# Altium schematic sheet [14] - PWR 5V, 3V3, 2V5.SchDoc
size A2; DocumentNumber: 14; SheetNumber: 14; SheetTotal: 18
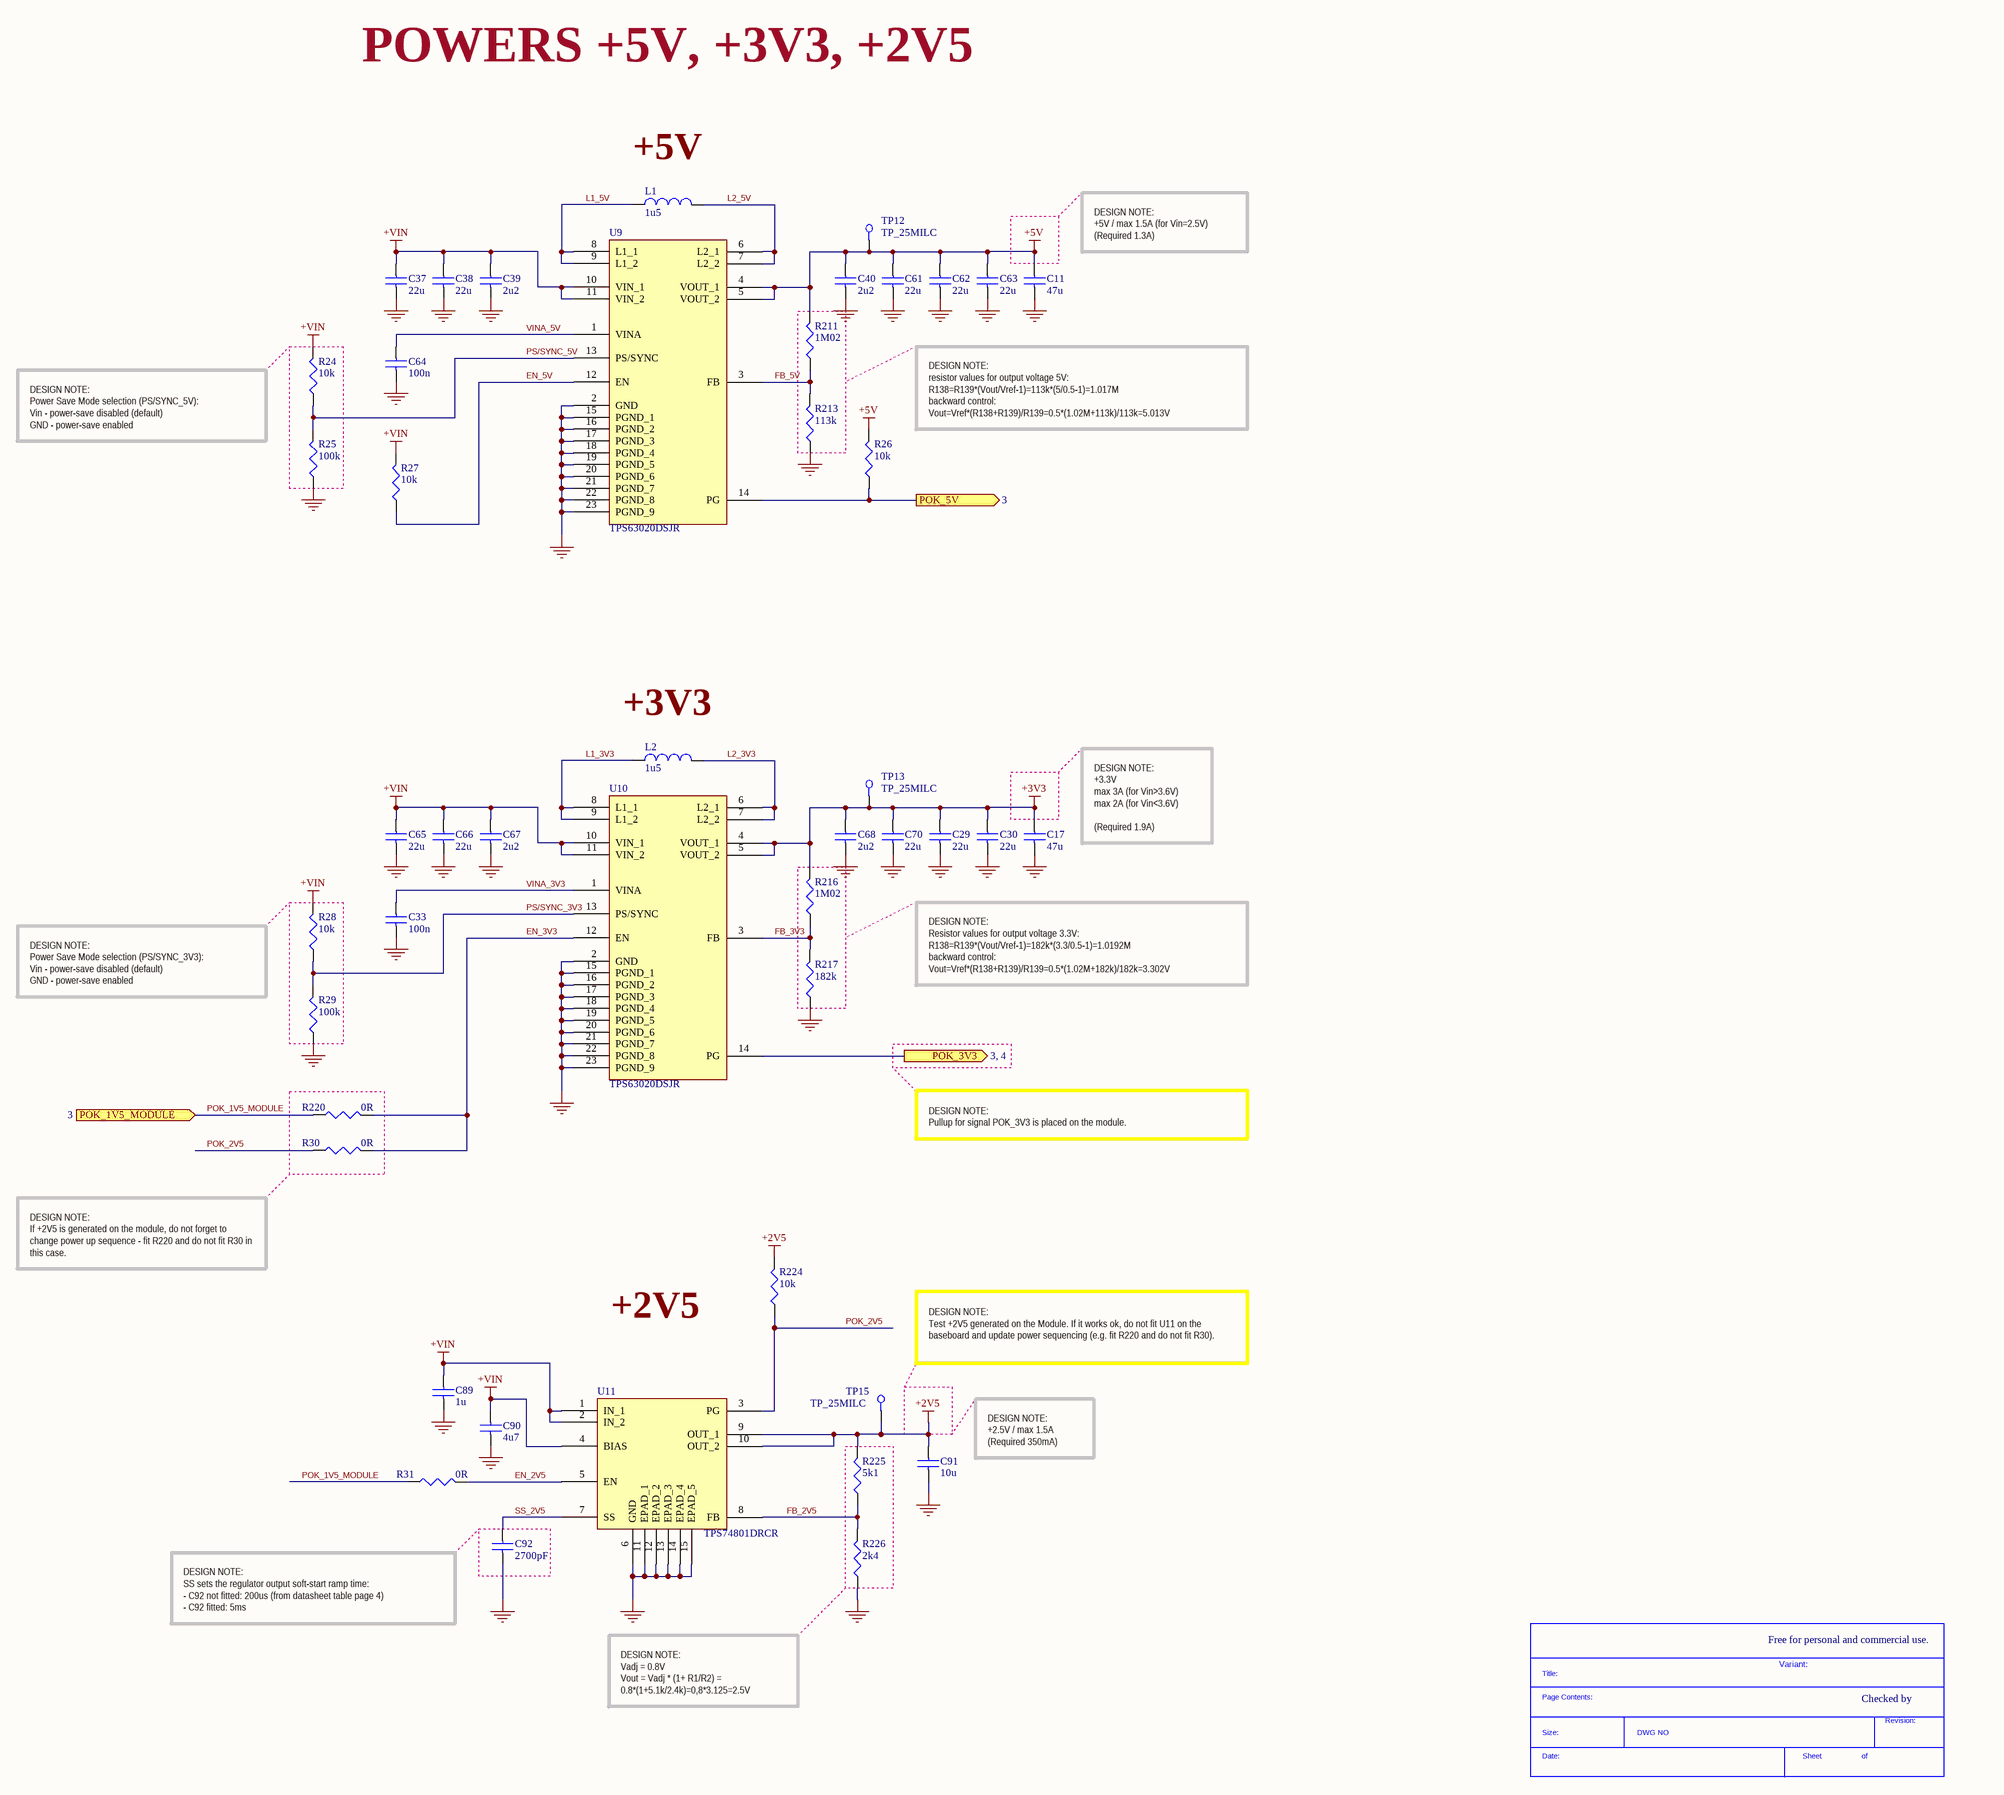
[diagram p0: [14] - PWR 5V, 3V3, 2V5.SchDoc]

## Parts
*  SDTitleBlock  (value not drawn)  (graphical)
C11  47u  [C0805]
C17  47u  [C0805]
C29  22u  [C0603]
C30  22u  [C0603]
C33  100n  [C0402]
C37  22u  [C0603]
C38  22u  [C0603]
C39  2u2  [C0402]
C40  2u2  [C0402]
C61  22u  [C0603]
C62  22u  [C0603]
C63  22u  [C0603]
C64  100n  [C0402]
C65  22u  [C0603]
C66  22u  [C0603]
C67  2u2  [C0402]
C68  2u2  [C0402]
C70  22u  [C0603]
C89  1u  [C0402]
C90  4u7  [C0402]
C91  10u  [C0603]
C92  2700pF  [C0402]
L1  1u5  [IHLP_204MILX216MIL]
L2  1u5  [IHLP_204MILX216MIL]
R24  10k  [R0402]
R25  100k  [R0402]
R26  10k  [R0402]
R27  10k  [R0402]
R28  10k  [R0402]
R29  100k  [R0402]
R30  0R  [R0402]
R31  0R  [R0402]
R211  1M02  [R0402]
R213  113k  [R0402]
R216  1M02  [R0402]
R217  182k  [R0402]
R220  0R  [R0402]
R224  10k  [R0402]
R225  5k1  [R0402]
R226  2k4  [R0402]
TP12  TP_25MILC  [TP_25C]  (no BOM)
TP13  TP_25MILC  [TP_25C]  (no BOM)
TP15  TP_25MILC  [TP_25C]  (no BOM)
U9  TPS63020DSJR  [DSJ (R-PVSON-N14)]
U10  TPS63020DSJR  [DSJ (R-PVSON-N14)]
U11  TPS74801DRCR  [DRC (S-PVSON-N10)]

## Ports
POK_1V5_MODULE (in, see 3), POK_3V3 (see 3, 4), POK_5V (out, see 3)

## Nets
+2V5: C91.1 R224.2 R225.2 TP15.1 U11.9(OUT_1) U11.10(OUT_2)
+3V3: C17.1 C29.1 C30.1 C68.1 C70.1 R216.2 TP13.1 U10.4(VOUT_1) U10.5(VOUT_2)
+5V: C11.1 C40.1 C61.1 C62.1 C63.1 R26.2 R211.2 TP12.1 U9.4(VOUT_1) U9.5(VOUT_2)
+VIN: C37.1 C38.1 C39.1 C65.1 C66.1 C67.1 C89.1 C90.1 R24.2 R27.2 R28.2 U9.10(VIN_1) U9.11(VIN_2) U10.10(VIN_1) U10.11(VIN_2) U11.1(IN_1) U11.2(IN_2) U11.4(BIAS)
GND: C11.2 C17.2 C29.2 C30.2 C33.2 C37.2 C38.2 C39.2 C40.2 C61.2 C62.2 C63.2 C64.2 C65.2 C66.2 C67.2 C68.2 C70.2 C89.2 C90.2 C91.2 C92.2 R25.1 R29.1 R213.1 R217.1 R226.1 U9.2(GND) U9.15(PGND_1) U9.16(PGND_2) U9.17(PGND_3) U9.18(PGND_4) U9.19(PGND_5) U9.20(PGND_6) U9.21(PGND_7) U9.22(PGND_8) U9.23(PGND_9) U10.2(GND) U10.15(PGND_1) U10.16(PGND_2) U10.17(PGND_3) U10.18(PGND_4) U10.19(PGND_5) U10.20(PGND_6) U10.21(PGND_7) U10.22(PGND_8) U10.23(PGND_9) U11.6(GND) U11.11(EPAD_1) U11.12(EPAD_2) U11.13(EPAD_3) U11.14(EPAD_4) U11.15(EPAD_5)
EN_2V5: R31.2 U11.5(EN)
EN_3V3: R30.2 R220.2 U10.12(EN)
EN_5V: R27.1 U9.12(EN)
FB_2V5: R225.1 R226.2 U11.8(FB)
FB_3V3: R216.1 R217.2 U10.3(FB)
FB_5V: R211.1 R213.2 U9.3(FB)
L1_3V3: L2.1 U10.8(L1_1) U10.9(L1_2)
L1_5V: L1.1 U9.8(L1_1) U9.9(L1_2)
L2_3V3: L2.2 U10.6(L2_1) U10.7(L2_2)
L2_5V: L1.2 U9.6(L2_1) U9.7(L2_2)
POK_1V5_MODULE: R31.1 R220.1 ; port POK_1V5_MODULE
POK_2V5: R30.1 R224.1 U11.3(PG)
POK_3V3: U10.14(PG) ; port POK_3V3
POK_5V: R26.1 U9.14(PG) ; port POK_5V
PS/SYNC_3V3: R28.1 R29.2 U10.13(PS/SYNC)
PS/SYNC_5V: R24.1 R25.2 U9.13(PS/SYNC)
SS_2V5: C92.1 U11.7(SS)
VINA_3V3: C33.1 U10.1(VINA)
VINA_5V: C64.1 U9.1(VINA)

## Notes on the sheet
- POWERS +5V, +3V3, +2V5
- (near L1) +5V
- DESIGN NOTE:
  +5V / max 1.5A (for Vin=2.5V)
  (Required 1.3A)
- DESIGN NOTE:
  Power Save Mode selection (PS/SYNC_5V):
  Vin - power-save disabled (default)
  GND - power-save enabled
- DESIGN NOTE:
  resistor values for output voltage 5V:
  R138=R139*(Vout/Vref-1)=113k*(5/0.5-1)=1.017M
  backward control:
  Vout=Vref*(R138+R139)/R139=0.5*(1.02M+113k)/113k=5.013V
- (near L2) +3V3
- DESIGN NOTE:
  +3.3V
  max 3A (for Vin>3.6V)
  max 2A (for Vin<3.6V)
  (Required 1.9A)
- DESIGN NOTE:
  Power Save Mode selection (PS/SYNC_3V3):
  Vin - power-save disabled (default)
  GND - power-save enabled
- DESIGN NOTE:
  Resistor values for output voltage 3.3V:
  R138=R139*(Vout/Vref-1)=182k*(3.3/0.5-1)=1.0192M
  backward control:
  Vout=Vref*(R138+R139)/R139=0.5*(1.02M+182k)/182k=3.302V
- DESIGN NOTE:
  Pullup for signal POK_3V3 is placed on the module.
- DESIGN NOTE:
  If +2V5 is generated on the module, do not forget to change power up sequence - fit R220 and do not fit R30 in this case.
- +2V5
- DESIGN NOTE:
  Test +2V5 generated on the Module. If it works ok, do not fit U11 on the baseboard and update power sequencing (e.g. fit R220 and do not fit R30).
- DESIGN NOTE:
  +2.5V / max 1.5A
  (Required 350mA)
- DESIGN NOTE:
  SS sets the regulator output soft-start ramp time:
  - C92 not fitted: 200us (from datasheet table page 4)
  - C92 fitted: 5ms
- Free for personal and commercial use.
- DESIGN NOTE:
  Vadj = 0.8V
  Vout = Vadj * (1+ R1/R2) = 0.8*(1+5.1k/2.4k)=0,8*3.125=2.5V
- Variant:
- Checked by
- (in symbol SDTitleBlock) Title:; Page Contents:; Revision:; Size:; DWG NO; Date:; Sheet; of

## Library data of the parts
C11 C17 = JMK212BJ476MG-T: CAP CER 47UF 6.3V 20% X5R 0805; Manufacturer: Taiyo Yuden; Capacitance: 47µF; .Creator: MM; Supplier 1: Digi-Key; Manufacturer Part Number: JMK212BJ476MG-T; RoHS: RoHS Compliant; Category: Capacitors; Stock 1: 34061; Pricing 1: 1=0.77, 10=0.737, 50=0.44, 100=0.3575, 250=0.297, 500=0.2695, 1000=0.2475 (USD); Packaging: Cut Tape (CT); Tolerance: ±20%; Voltage - Rated: 6.3V; Temperature Coefficient: X5R; Mounting Type: Surface Mount, MLCC; Operating Temperature: -55°C ~ 85°C; Applications: General Purpose; Ratings: -; Package / Case: 0805 (2012 Metric); Size / Dimension: 0.079" L x 0.049" W (2.00mm x 1.25mm); Height - Seated (Max): -; Thickness (Max): 0.053" (1.35mm); Lead Spacing: -; Features: -; Lead Style: -; ComponentLink1URL: http://www.yuden.co.jp/productdata/catalog/en/mlcc_all_e.pdf; ComponentLink1Description: http://www.yuden.co.jp/productdata/catalog/en/mlcc_all_e.pdf; Supplier Part Number 1: 587-1779-1-ND; .Checked SCH: MM; .Checked PCB: MM
C29 C30 C37 C38 C61-C63 C65 C66 C70 = C1608X5R0J226M080AC: CAP CER 22UF 6.3V 20% X5R 0603; Manufacturer: TDK Corporation; Capacitance: 22µF; .Creator: MM; Supplier 1: Digi-Key; Manufacturer Part Number: C1608X5R0J226M080AC; RoHS: RoHS Compliant; Category: Capacitors; Stock 1: 593047; Pricing 1: 1=0.39, 10=0.343, 100=0.1714, 250=0.13708, 500=0.12484, 1000=0.1104 (USD); Packaging: Cut Tape (CT); Tolerance: ±20%; Voltage - Rated: 6.3V; Temperature Coefficient: X5R; Mounting Type: Surface Mount, MLCC; Operating Temperature: -55°C ~ 85°C; Applications: General Purpose; Ratings: -; Package / Case: 0603 (1608 Metric); Size / Dimension: 0.063" L x 0.031" W (1.60mm x 0.80mm); Height - Seated (Max): -; Thickness (Max): 0.039" (1.00mm); Lead Spacing: -; Features: -; Lead Style: -; ComponentLink1URL: http://product.tdk.com/en/catalog/datasheets/mlcc_commercial_general_en.pdf; ComponentLink1Description: http://product.tdk.com/en/catalog/datasheets/mlcc_commercial_general_en.pdf; Supplier Part Number 1: 445-8028-1-ND; .Checked PCB: MM; .Checked SCH: MM
C33 C64 = C1005X5R1H104K: CAP CER .10UF 50V X5R 10% 0402; Manufacturer: TDK Corporation; Capacitance: 0.1µF; Value: 100nF; .Checked PCB: used; Category: Capacitors; Supplier Part Number: 445-5942-1-ND; Manufacturer Part Number: C1005X5R1H104K; Operating Temperature: -55°C ~ 85°C; Package / Case: 0402 (1005 Metric); Price 1k [$]: 0.02340; .Checked SCH: used; Voltage - Rated: 50V; Supplier: Digikey; Supplier 1: Digi-Key; Supplier Part Number 1: 445-5942-1-ND; RoHS: RoHS Compliant; Stock 1: 106926; Pricing 1: 1=0.27, 10=0.18, 100=0.072, 250=0.05176, 500=0.0369, 1000=0.027 (USD); Tolerance: ±10%; Temperature Coefficient: X5R; Mounting Type: Surface Mount, MLCC; Applications: General Purpose; Ratings: -; Size / Dimension: 0.039" L x 0.020" W (1.00mm x 0.50mm); Height - Seated (Max): -; Thickness (Max): 0.022" (0.55mm); Lead Spacing: -; Features: -; Packaging: Cut Tape (CT); Lead Style: -; ComponentLink1URL: http://www.tdk.co.jp/tefe02/e412_c.pdf; ComponentLink1Description: http://www.tdk.co.jp/tefe02/e412_c.pdf
C39 C40 C67 C68 = C1005X5R1A225K: CAP CER 2.2UF 10V 10% X5R 0402; Manufacturer: TDK Corporation; Capacitance: 2.2µF; .Checked PCB: used; Supplier 1: Digi-Key; Supplier Part Number 1: 445-7392-1-ND; Manufacturer Part Number: C1005X5R1A225K; RoHS: RoHS Compliant; Category: Capacitors; Stock 1: 22891; Pricing 1: 1=0.42, 10=0.332, 100=0.2, 250=0.15, 500=0.128, 1000=0.1 (USD); Voltage - Rated: 10V; Tolerance: ±10%; Temperature Coefficient: X5R; Mounting Type: Surface Mount, MLCC; Operating Temperature: -55°C ~ 85°C; Applications: General Purpose; Ratings: -; Package / Case: 0402 (1005 Metric); Size / Dimension: 0.039" L x 0.020" W (1.00mm x 0.50mm); Height - Seated (Max): -; Thickness (Max): 0.022" (0.55mm); Lead Spacing: -; Features: -; Packaging: Cut Tape (CT); Lead Style: -; ComponentLink1URL: http://www.tdk.com/pdf/general_B11.pdf; ComponentLink1Description: http://www.tdk.com/pdf/general_B11.pdf; .Checked SCH: used
C89 = C1005X5R1C105K: CAP CER 1.0UF 16V X5R 0402; Manufacturer: TDK Corporation; Capacitance: 1.0µF; Value: 1uF; .Checked PCB: used; Tolerance: ±10%; Category: Capacitors; Supplier Part Number: 445-4978-1-ND; Manufacturer Part Number: C1005X5R1C105K; Operating Temperature: -55°C ~ 85°C; Package / Case: 0402 (1005 Metric); Price 1k [$]: 0.02080; .Checked SCH: used; Voltage - Rated: 16V; Supplier: Digikey; Supplier 1: Digi-Key; Supplier Part Number 1: 445-4978-1-ND; RoHS: RoHS Compliant; Stock 1: 341010; Pricing 1: 1=0.24, 10=0.16, 100=0.064, 250=0.046, 500=0.0328, 1000=0.024 (USD); Temperature Coefficient: X5R; Mounting Type: Surface Mount, MLCC; Applications: General Purpose; Ratings: -; Size / Dimension: 0.039" L x 0.020" W (1.00mm x 0.50mm); Height - Seated (Max): -; Thickness (Max): 0.022" (0.55mm); Lead Spacing: -; Features: -; Packaging: Cut Tape (CT); Lead Style: -; ComponentLink1URL: http://www.tdk.co.jp/tefe02/e412_c.pdf; ComponentLink1Description: http://www.tdk.co.jp/tefe02/e412_c.pdf
C90 = C1005X5R1A475M: CAP CER 4.7UF 10V 20% X5R 0402; Manufacturer: TDK Corporation; Capacitance: 4.7µF; .Checked PCB: used; Supplier 1: Digi-Key; Supplier Part Number 1: 445-8023-1-ND; Manufacturer Part Number: C1005X5R1A475M; RoHS: RoHS Compliant; Category: Capacitors; Stock 1: 10140; Pricing 1: 1=0.53, 10=0.415, 100=0.25, 250=0.18752, 500=0.16, 1000=0.125, 5000=0.095 (USD); Voltage - Rated: 10V; Tolerance: ±20%; Temperature Coefficient: X5R; Mounting Type: Surface Mount, MLCC; Operating Temperature: -55°C ~ 85°C; Applications: General Purpose; Ratings: -; Package / Case: 0402 (1005 Metric); Size / Dimension: 0.039" L x 0.020" W (1.00mm x 0.50mm); Height - Seated (Max): -; Thickness (Max): -; Lead Spacing: -; Features: -; Packaging: Cut Tape (CT); Lead Style: -; ComponentLink1URL: http://www.tdk.com/pdf/general_B11.pdf; ComponentLink1Description: http://www.tdk.com/pdf/general_B11.pdf; .Checked SCH: used
C91 = C1608X5R0J106M: CAP CER 10UF 6.3V X5R 20% 0603; Manufacturer: TDK Corporation; Capacitance: 10µF; Value: 10µF; .Checked PCB: used; Category: Capacitors; Supplier Part Number: 445-4112-1-ND; Manufacturer Part Number: C1608X5R0J106M; Operating Temperature: -55°C ~ 85°C; Package / Case: 0603 (1608 Metric); Price 1k [$]: 0.08580; .Checked SCH: used; Voltage - Rated: 6.3V; Features: Low ESR; Supplier: Digikey; Supplier 1: Digi-Key; Supplier Part Number 1: 445-4112-1-ND; RoHS: RoHS Compliant; Stock 1: 48157; Pricing 1: 1=0.46, 10=0.363, 100=0.1898, 250=0.14024, 500=0.1089, 1000=0.0858 (USD); Tolerance: ±20%; Temperature Coefficient: X5R; Mounting Type: Surface Mount, MLCC; Applications: General Purpose; Ratings: -; Size / Dimension: 0.063" L x 0.031" W (1.60mm x 0.80mm); Height - Seated (Max): -; Thickness (Max): 0.037" (0.95mm); Lead Spacing: -; Packaging: Cut Tape (CT); Lead Style: -; ComponentLink1URL: http://www.tdk.com/pdf/general_B11.pdf; ComponentLink1Description: http://www.tdk.com/pdf/general_B11.pdf
C92 = GRM155R71H272KA01D: CAP CER 2700PF 50V 10% X7R 0402; Manufacturer: Murata Electronics North America; .Checked PCB: used; Supplier 1: Digi-Key; Supplier Part Number 1: 490-1306-1-ND; Manufacturer Part Number: GRM155R71H272KA01D; RoHS: RoHS Compliant; Category: Capacitors; Stock 1: 38160; Pricing 1: 10=0.01, 50=0.0086, 100=0.0074, 250=0.00664, 500=0.00618, 750=0.00571, 1000=0.00542 (USD); Capacitance: 2700pF; Voltage - Rated: 50V; Tolerance: ±10%; Temperature Coefficient: X7R; Mounting Type: Surface Mount, MLCC; Operating Temperature: -55°C ~ 125°C; Applications: General Purpose; Ratings: -; Package / Case: 0402 (1005 Metric); Size / Dimension: 0.039" L x 0.020" W (1.00mm x 0.50mm); Height - Seated (Max): -; Thickness (Max): 0.022" (0.55mm); Lead Spacing: -; Features: -; Packaging: Cut Tape (CT); Lead Style: -; ComponentLink1URL: http://search.murata.co.jp/Ceramy/image/img/PDF/ENG/GRM155R71H272KA01.pdf; ComponentLink1Description: http://search.murata.co.jp/Ceramy/image/img/PDF/ENG/GRM155R71H272KA01.pdf; .Checked SCH: used
L1 L2 = IHLP2020CZER1R5M11: FIXED IND 1.5UH 7.5A 18.5 MOHM; Manufacturer: Vishay Dale; Type: Molded; Inductance: 1.5µH; Tolerance: ±20%; Current - Saturation: 7A; Shielding: Shielded; DC Resistance (DCR): 18.5 mOhm Max; Frequency - Self Resonant: 39MHz; Frequency - Test: 100kHz; .Creator: MM; Supplier 1: Digi-Key; Manufacturer Part Number: IHLP2020CZER1R5M11; RoHS: RoHS Compliant; Category: Inductors, Coils, Chokes; Stock 1: 5892; Pricing 1: 1=2.4, 10=2.24, 100=1.664, 500=1.408, 1000=1.312 (USD); Packaging: Cut Tape (CT); Material - Core: -; Current Rating: 7.5A; Q @ Freq: -; Operating Temperature: -55°C ~ 125°C; Mounting Type: Surface Mount; Package / Case: Non Standard; Size / Dimension: 0.216" L x 0.204" W (5.49mm x 5.18mm); Height - Seated (Max): 0.118" (3.00mm); Supplier Device Package: -; ComponentLink1URL: http://www.vishay.com/docs/34260/lp20cz11.pdf; ComponentLink1Description: http://www.vishay.com/docs/34260/lp20cz11.pdf; Supplier Part Number 1: 541-1235-1-ND; .Checked PCB: MM; .Checked SCH: MM
R24 R26-R28 R224 = RC0402FR-0710KL: RES 10.0K OHM 1/16W 1% 0402 SMD; Manufacturer: Yageo; Power (Watts): 0.063W, 1/16W; .Checked PCB: used; Temperature Coefficient: ±100ppm/°C; Category: Resistors; Supplier Part Number: 311-10.0KLRCT-ND; Manufacturer Part Number: RC0402FR-0710KL; Package / Case: 0402 (1005 Metric); Price 1k [$]: 0.01421; Resistance (Ohms): 10K; Tolerance: ±1%; Value: 10k; .Checked SCH: used; Supplier: Digikey; Supplier 1: Digi-Key; Supplier Part Number 1: 311-10.0KLRCT-ND; RoHS: RoHS Compliant; Stock 1: 2916495; Pricing 1: 10=0.014, 50=0.0104, 100=0.0079, 250=0.00584, 500=0.00432, 1000=0.00288 (USD); Composition: Thick Film; Features: -; Size / Dimension: 0.039" L x 0.020" W (1.00mm x 0.50mm); Height: 0.016" (0.40mm); Number of Terminations: 2; Packaging: Cut Tape (CT); ComponentLink1URL: http://www.yageo.com/documents/recent/PYu-RC0402_51_RoHS_L_6.pdf; ComponentLink1Description: http://www.yageo.com/documents/recent/PYu-RC0402_51_RoHS_L_6.pdf
R25 R29 = RMCF0402FT100K: RES 100K OHM 1/16W 1% 0402 SMD; Manufacturer: Stackpole Electronics Inc; Power (Watts): 0.063W, 1/16W; .Checked PCB: used; Temperature Coefficient: ±100ppm/°C; Category: Resistors; Supplier Part Number: RMCF0402FT100KCT-ND; Manufacturer Part Number: RMCF0402FT100K; Package / Case: 0402 (1005 Metric); Price 1k [$]: 0.00384; Resistance (Ohms): 100K; Tolerance: ±1%; Value: 100k; .Checked SCH: used; Supplier: Digikey; Supplier 1: Digi-Key; Supplier Part Number 1: RMCF0402FT100KCT-ND; RoHS: RoHS Compliant; Stock 1: 95; Pricing 1: 1=0.04, 10=0.025, 50=0.0138, 100=0.0105, 250=0.0078, 500=0.00576, 1000=0.00384 (USD); Composition: Thick Film; Features: -; Size / Dimension: 0.039" L x 0.020" W (1.00mm x 0.50mm); Height: 0.016" (0.40mm); Number of Terminations: 2; Packaging: Cut Tape (CT); ComponentLink1URL: http://www.seielect.com/Catalog/SEI-RMCF.pdf; ComponentLink1Description: http://www.seielect.com/Catalog/SEI-RMCF.pdf
R30 R31 R220 = RC0402JR-070RL: RES 0.0 OHM 1/16W 0402 SMD; Manufacturer: Yageo; Resistance (Ohms): 0.0; Power (Watts): 0.063W, 1/16W; Tolerance: Jumper; .Checked PCB: used; Category: Resistors; Supplier Part Number: 311-0.0JRCT-ND; Manufacturer Part Number: RC0402JR-070RL; Package / Case: 0402 (1005 Metric); Price 1k [$]: 0.01389; Value: 0R; .Checked SCH: used; Supplier: Digikey; Supplier 1: Digi-Key; Supplier Part Number 1: 311-0.0JRCT-ND; RoHS: RoHS Compliant; Stock 1: 1106330; Pricing 1: 10=0.012, 50=0.009, 100=0.0069, 250=0.00512, 500=0.0038, 1000=0.00253 (USD); Composition: Thick Film; Features: -; Temperature Coefficient: -; Size / Dimension: 0.039" L x 0.020" W (1.00mm x 0.50mm); Height: 0.016" (0.40mm); Number of Terminations: 2; Packaging: Cut Tape (CT); ComponentLink1URL: http://www.yageo.com/documents/recent/PYu-RC0402_51_RoHS_L_6.pdf; ComponentLink1Description: http://www.yageo.com/documents/recent/PYu-RC0402_51_RoHS_L_6.pdf
R211 R216 = CRCW04021M02FKED: RES 1.02M OHM 1/16W 1% 0402 SMD; Manufacturer: Vishay Dale; Power (Watts): 0.063W, 1/16W; Temperature Coefficient: ±100ppm/°C; .Creator: MM; Supplier 1: Digi-Key; Manufacturer Part Number: CRCW04021M02FKED; RoHS: RoHS Compliant; Category: Resistors; Stock 1: 38338; Pricing 1: 10=0.083, 50=0.0444, 200=0.0255, 1000=0.0174 (USD); Packaging: Cut Tape (CT); Resistance (Ohms): 1.02M; Tolerance: ±1%; Composition: Thick Film; Features: Automotive AEC-Q200 Qualified; Package / Case: 0402 (1005 Metric); Supplier Device Package: 0402 (1005 Metric); Size / Dimension: 0.039" L x 0.020" W (1.00mm x 0.50mm); Height: 0.016" (0.40mm); Number of Terminations: 2; ComponentLink1URL: http://www.vishay.com/docs/20035/dcrcwe3.pdf; ComponentLink1Description: http://www.vishay.com/docs/20035/dcrcwe3.pdf; Supplier Part Number 1: 541-1.02MLCT-ND; .Checked PCB: MM; .Checked SCH: MM
R213 = CRCW0402113KFKED: RES 113K OHM 1/16W 1% 0402 SMD; Manufacturer: Vishay Dale; Power (Watts): 0.063W, 1/16W; Temperature Coefficient: ±100ppm/°C; .Creator: MM; Supplier 1: Digi-Key; Manufacturer Part Number: CRCW0402113KFKED; RoHS: RoHS Compliant; Category: Resistors; Stock 1: 66504; Pricing 1: 10=0.083, 50=0.0444, 200=0.0255, 1000=0.0174 (USD); Packaging: Cut Tape (CT); Resistance (Ohms): 113k; Tolerance: ±1%; Composition: Thick Film; Features: Automotive AEC-Q200 Qualified; Package / Case: 0402 (1005 Metric); Supplier Device Package: 0402 (1005 Metric); Size / Dimension: 0.039" L x 0.020" W (1.00mm x 0.50mm); Height: 0.016" (0.40mm); Number of Terminations: 2; ComponentLink1URL: http://www.vishay.com/docs/20035/dcrcwe3.pdf; ComponentLink1Description: http://www.vishay.com/docs/20035/dcrcwe3.pdf; Supplier Part Number 1: 541-113KLCT-ND; .Checked PCB: MM; .Checked SCH: MM
R217 = CRCW0402182KFKED: RES 182K OHM 1/16W 1% 0402 SMD; Manufacturer: Vishay Dale; Power (Watts): 0.063W, 1/16W; Temperature Coefficient: ±100ppm/°C; .Creator: MM; Supplier 1: Digi-Key; Manufacturer Part Number: CRCW0402182KFKED; RoHS: RoHS Compliant; Category: Resistors; Stock 1: 98035; Pricing 1: 10=0.083, 50=0.0444, 200=0.0255, 1000=0.0174 (USD); Packaging: Cut Tape (CT); Resistance (Ohms): 182k; Tolerance: ±1%; Composition: Thick Film; Features: Automotive AEC-Q200 Qualified; Package / Case: 0402 (1005 Metric); Supplier Device Package: 0402 (1005 Metric); Size / Dimension: 0.039" L x 0.020" W (1.00mm x 0.50mm); Height: 0.016" (0.40mm); Number of Terminations: 2; ComponentLink1URL: http://www.vishay.com/docs/20035/dcrcwe3.pdf; ComponentLink1Description: http://www.vishay.com/docs/20035/dcrcwe3.pdf; Supplier Part Number 1: 541-182KLCT-ND; .Checked PCB: MM; .Checked SCH: MM
R225 = RC0402FR-075K1L: RES 5.10K OHM 1/16W 1% 0402 SMD; Manufacturer: Yageo; Resistance (Ohms): 5.1K; Power (Watts): 0.063W, 1/16W; .Checked PCB: RF; Temperature Coefficient: ±100ppm/°C; Category: Resistors; Supplier Part Number: 311-5.10KLRCT-ND; Manufacturer Part Number: RC0402FR-075K1L; Package / Case: 0402 (1005 Metric); Price 1k [$]: 0.00288; Tolerance: ±1%; Value: 5k1; .Checked SCH: RF; Supplier: Digikey; Supplier 1: Digi-Key; Supplier Part Number 1: 311-5.10KLRCT-ND; RoHS: RoHS Compliant; Stock 1: 571594; Pricing 1: 10=0.014, 50=0.0104, 100=0.0079, 250=0.00584, 500=0.00432, 1000=0.00288 (USD); Composition: Thick Film; Features: -; Size / Dimension: 0.039" L x 0.020" W (1.00mm x 0.50mm); Height: 0.016" (0.40mm); Number of Terminations: 2; Packaging: Cut Tape (CT); ComponentLink1URL: http://www.yageo.com/documents/recent/PYu-RC0402_51_RoHS_L_6.pdf; ComponentLink1Description: http://www.yageo.com/documents/recent/PYu-RC0402_51_RoHS_L_6.pdf
R226 = CRCW04022K40FKED: RES 2.40K OHM 1/16W 1% 0402 SMD; Manufacturer: Vishay Dale; Resistance (Ohms): 2.4K; Power (Watts): 0.063W, 1/16W; Temperature Coefficient: ±100ppm/°C; .Checked PCB: used; Supplier 1: Digi-Key; Supplier Part Number 1: 541-2.40KLCT-ND; Manufacturer Part Number: CRCW04022K40FKED; RoHS: RoHS Compliant; Category: Resistors; Stock 1: 43967; Pricing 1: 10=0.083, 50=0.0444, 200=0.0255, 1000=0.0174 (USD); Composition: Thick Film; Features: -; Tolerance: ±1%; Package / Case: 0402 (1005 Metric); Size / Dimension: 0.039" L x 0.020" W (1.00mm x 0.50mm); Height: 0.016" (0.40mm); Number of Terminations: 2; Packaging: Cut Tape (CT); ComponentLink1URL: http://www.vishay.com/doc?20035; ComponentLink1Description: http://www.vishay.com/doc?20035; .Checked SCH: used
TP12 TP13 TP15 = TP_25MILC: Test Point 25mil
U9 U10 = TPS63020DSJR: IC REG BUCK BST SYNC ADJ 14VSON; Manufacturer: Texas Instruments; Output Type: Adjustable; Number of Outputs: 1; Voltage - Output: 1.2 V ~ 5.5 V; Voltage - Input: 1.8 V ~ 5.5 V; Frequency - Switching: 2.4MHz; Current - Output: 3A; Synchronous Rectifier: Yes; .Creator: MM; Supplier 1: Digi-Key; Manufacturer Part Number: TPS63020DSJR; RoHS: RoHS Compliant; Category: Integrated Circuits (ICs); Stock 1: 3608; Pricing 1: 1=4.92, 10=4.412, 25=3.9672, 100=3.6081, 250=3.26612, 500=2.9241, 750=2.65051, 1000=2.1375 (USD); Packaging: Cut Tape (CT); Type: Step-Down (Buck), Step-Up (Boost); Operating Temperature: -40°C ~ 85°C; Mounting Type: Surface Mount; Package / Case: 14-VFDFN Exposed Pad; Supplier Device Package: 14-VSON (4x3); ComponentLink1URL: http://www.ti.com/lit/ds/symlink/tps63020.pdf; ComponentLink1Description: http://www.ti.com/lit/ds/symlink/tps63020.pdf; Supplier Part Number 1: 296-36491-1-ND; .Checked PCB: MM; .Checked SCH: MM
U11 = TPS74801DRCR: IC REG LDO ADJ 1.5A 10SON; Manufacturer: Texas Instruments; Number of Regulators: 1; Regulator Topology: Positive Adjustable; Voltage - Input: 0.8 V ~ 5.5 V; Voltage - Output: 0.8 V ~ 3.6 V; Voltage - Dropout (Typical): 0.06V @ 1.5A; Current - Output: 1.5A (Max); Current - Limit (Min): 2A; .Creator: MM; .Checked PCB: used; Supplier 1: Digi-Key; Manufacturer Part Number: TPS74801DRCR; RoHS: RoHS Compliant; Category: Integrated Circuits (ICs); Stock 1: 11680; Pricing 1: 1=2.3, 10=2.074, 25=1.8576, 100=0.972, 250=0.954, 500=0.936, 750=0.918 (USD); Packaging: Cut Tape (CT); Operating Temperature: -40°C ~ 125°C; Mounting Type: Surface Mount; Package / Case: 10-VFDFN Exposed Pad; Supplier Device Package: 10-SON (3x3); ComponentLink1URL: http://www.ti.com/lit/ds/symlink/tps74801.pdf; ComponentLink1Description: http://www.ti.com/lit/ds/symlink/tps74801.pdf; Supplier Part Number 1: 296-21563-1-ND; .Checked SCH: used